# EAGLE design 1932dev (EAGLE 6.4)
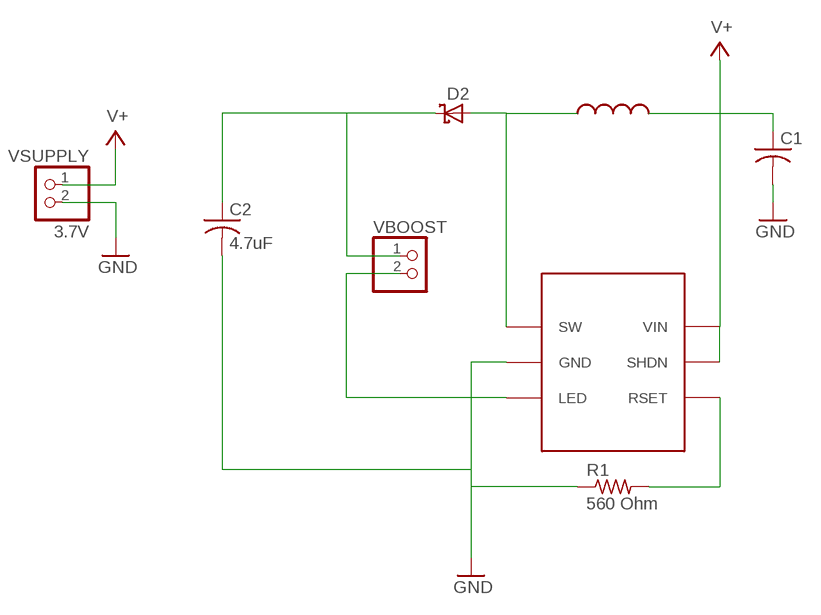
[diagram p0: schematic, sheet 1]

## Parts
C1  C-USC0805  [C0805]
C2  4.7uF  C-USC0805  [C0805]
D2  SCHOTTKY-DIODE  [SOD-323]
L1  10uH  MURATA_11R103C  [682C]
R1  560 Ohm  R-US_0411/3V  [0411V]
U$1  LT1932ES  [6PIN_SOT23]
VBOOST  PINHD-1X2  [1X02]
VSUPPLY  3.7V  PINHD-1X2  [1X02]

## Nets
GND: C1.2 C2.2 R1.1 U$1.PIN_2(GND) VSUPPLY.2
L1: D2.A L1.P$3(PIN_1) U$1.PIN_1(SW)
N$1: U$1.PIN_3(LED) VBOOST.2
N$2: R1.2 U$1.PIN_4(RSET)
N$3: C2.1 D2.C VBOOST.1
V+: C1.1 L1.P$4(PIN_2) U$1.PIN_5(SHDN) U$1.PIN_6(VIN) VSUPPLY.1

## Library data of the parts
C1 C2 = adafruit:C-US: CAPACITOR, American symbol
D2 = keen:SCHOTTKY-DIODE: Schottky Diode
L1 = keen:MURATA_11R103C
R1 = adafruit:R-US_: RESISTOR, American symbol
U$1 = keen:LT1932ES
VBOOST VSUPPLY = pinhead:PINHD-1X2: PIN HEADER

## Board
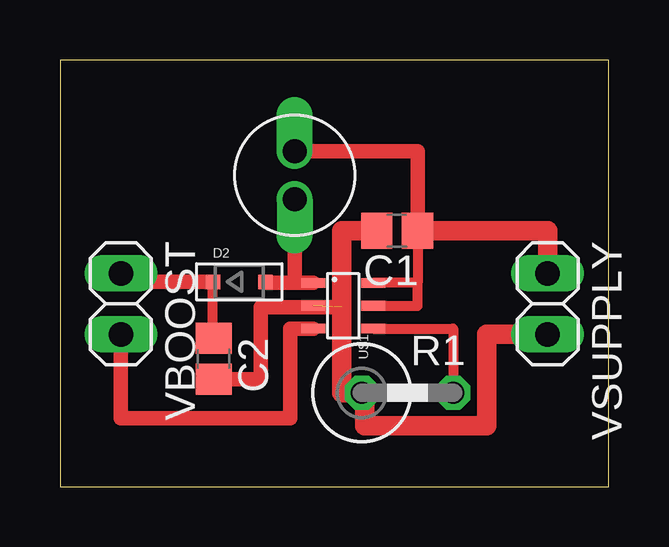
[diagram p1: board, top side]

Size 22.86 x 17.78 mm. Coordinates in mm from the lower left corner, seen from the top.
Outline: 0,0 22.86,0 22.86,17.78 0,17.78 0,0
Copper layers (1*16): Top 0.035mm / dielectric 1.5mm / Bottom 0.035mm
Design rules "EagleRules": minimum track width 7mil, minimum drill 12mil, track to track 7mil, track to pad 7mil, pad to pad 7mil, via to via 7mil, smd to smd 0mil, copper to edge 20mil, drill to drill 10mil, minimum pad ring 10mil, minimum via ring 6mil, stop-mask expansion 2mil, vias tented up to drill 25mil, thermal gap 10mil

### Footprints (pad centres in the part's own frame; a part is rotated, then mirrored left to right if it is on the bottom)
C0805 = smd 1.3 x 1.5: 1 -0.85,0; 2 0.85,0
SOD-323 = smd 0.6 x 0.6: A 1.1,0; C -1.1,0
682C = drill 1 offset: P$3 1,0; P$4 -1,0
0411V = drill 0.914 octagon: 1 -2.54,0; 2 1.27,0
6PIN_SOT23 = smd 0.4 x 1: PIN_1 0.4,-1.9; PIN_2 1.35,-1.9; PIN_3 2.3,-1.9; PIN_4 2.3,0.6; PIN_5 1.35,0.6; PIN_6 0.4,0.6
1X02 = drill 1.016 long: 1 -1.27,0; 2 1.27,0

### Placement (x,y rotation side)
C1  14.05,10.67 180 top
C2  6.4,5.33 270 top
D2  7.47,8.53 0 top
L1  9.78,12.98 270 top
R1  15.11,3.91 0 top
U$1  12.45,8.89 270 top
VBOOST  2.54,7.62 270 top
VSUPPLY  20.32,7.62 270 top

### Tracks (layer width: path | path; a pad name or v marks a point on that pad's centre or on a via)
GND  (1 unrouted)
  Top 0.61: C2.2 8.36,4.48 8.36,7.47 11.73,7.47
  Top 0.813: C1.2 11.73,10.67 11.73,7.47 11.73,3.91 R1.1 12.7,3.91 12.7,2.54 17.78,2.54 17.78,6.35 VSUPPLY.2
L1
  Top 0.61: D2.A 8.57,8.49 9.78,8.49 | 9.78,8.49 U$1.PIN_1 | L1.P$3 9.78,8.49
N$1
  Top 0.61: U$1.PIN_3 9.6,6.59 9.6,2.85 2.54,2.85 VBOOST.2
N$2
  Top 0.406: U$1.PIN_4 16.38,6.59 R1.2
N$3
  Top 0.406: C2.1 6.37,6.18 D2.C
  Top 0.61: D2.C 2.54,8.53 VBOOST.1
V+
  Top 0.406: C1.1 14.9,8.49 | 14.9,8.49 U$1.PIN_6 | U$1.PIN_5 14.9,7.54 14.9,8.49
  Top 0.61: C1.1 14.9,13.98 L1.P$4
  Top 0.813: C1.1 20.32,10.67 VSUPPLY.1